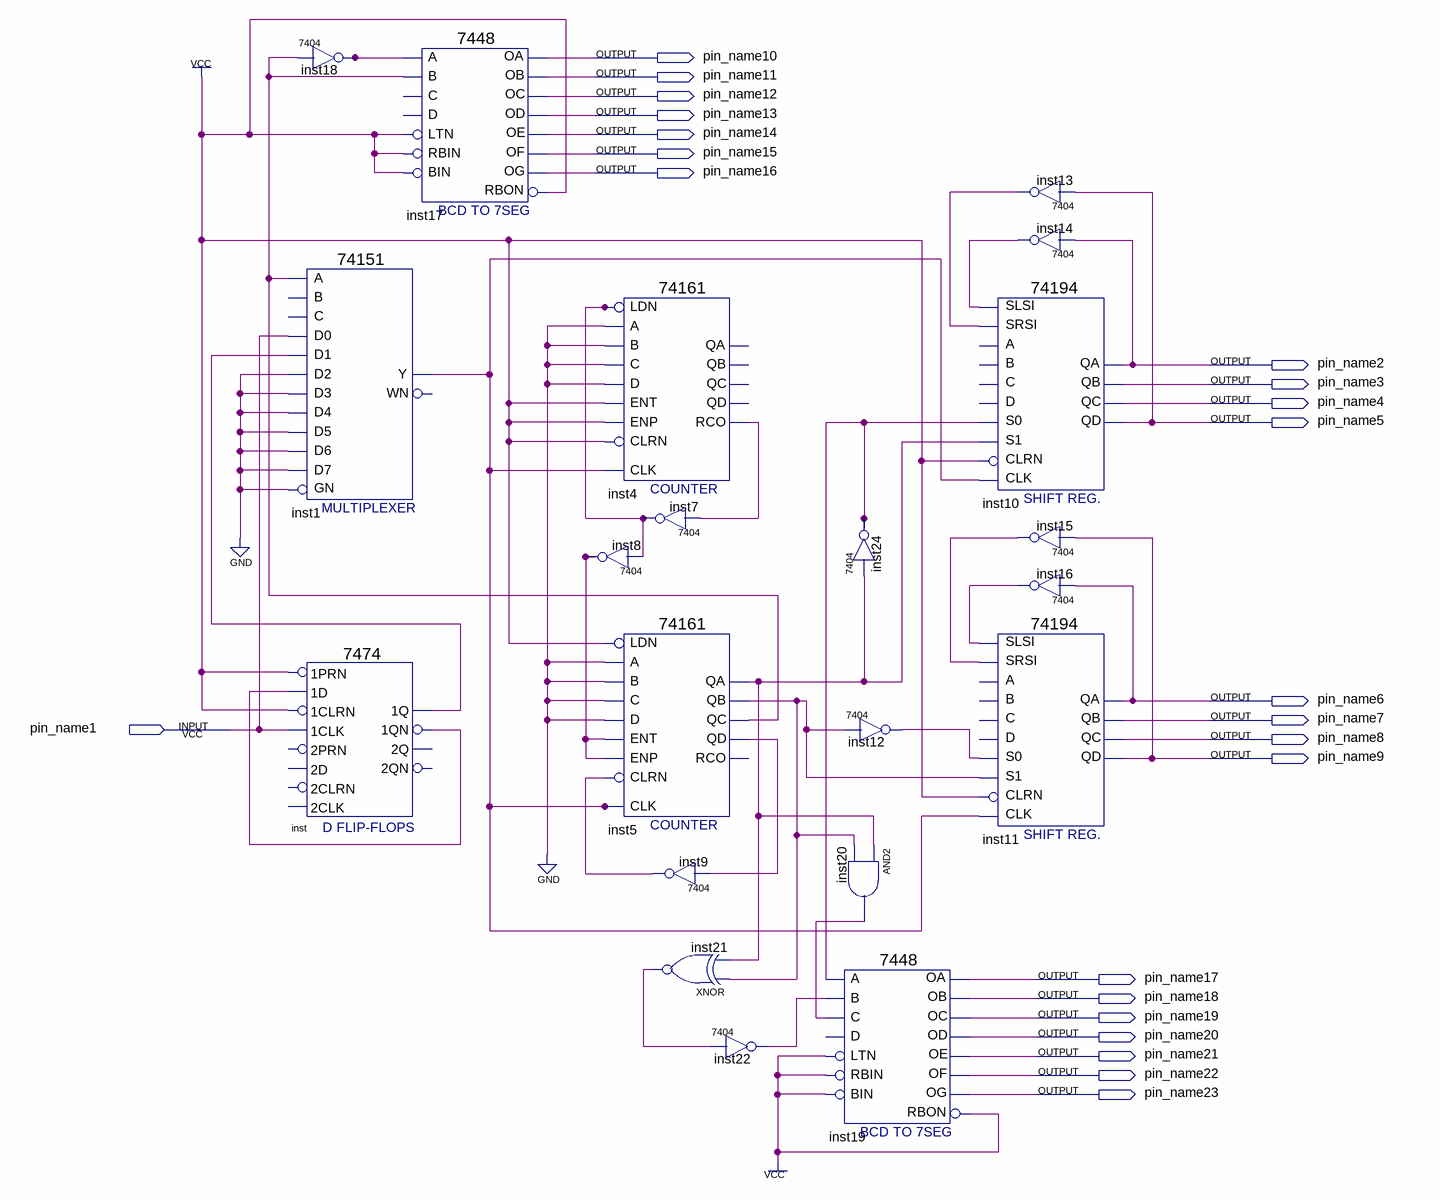
[diagram p0: schematic sheet]
// Quartus schematic first.bdf as structural Verilog: 21 symbols, 23 pins
module first (
  input  pin_name1,
  output pin_name10,
  output pin_name11,
  output pin_name12,
  output pin_name13,
  output pin_name14,
  output pin_name15,
  output pin_name16,
  output pin_name2,
  output pin_name3,
  output pin_name4,
  output pin_name5,
  output pin_name6,
  output pin_name7,
  output pin_name8,
  output pin_name9,
  output pin_name17,
  output pin_name18,
  output pin_name19,
  output pin_name20,
  output pin_name21,
  output pin_name22,
  output pin_name23
);

  wire inst1_y, inst4_rco, inst5_qa, inst5_qb, inst5_qc, inst5_qd, inst7_1, inst8_1, inst9_1, inst12_1,
       inst13_1, inst14_1, inst15_1, inst16_1, inst17_rbon, inst18_1, inst19_rbon, inst20_out, inst21_out,
       inst22_1, inst24_1, inst_1q, inst_1qn;

  \7404  inst18 (.\2 (inst5_qc), .\1 (inst18_1));
  \74151  inst1 (
    .GN(1'b0), .A(inst5_qc), .D5(1'b0), .D0(pin_name1), .D1(inst_1q), .D4(1'b0), .D3(1'b0), .D2(1'b0),
    .D6(1'b0), .D7(1'b0), .Y(inst1_y));  // open: C, B, WN
  \7474  inst (
    .\1CLK (pin_name1), .\1D (inst_1qn), .\1PRN (inst17_rbon), .\1CLRN (inst17_rbon), .\1QN (inst_1qn),
    .\1Q (inst_1q));  // open: 2D, 2PRN, 2CLK, 2CLRN, 2Q, 2QN
  \7448  inst17 (
    .A(inst18_1), .B(inst5_qc), .RBIN(inst17_rbon), .BIN(inst17_rbon), .LTN(inst17_rbon), .OC(pin_name12),
    .OE(pin_name14), .OD(pin_name13), .OF(pin_name15), .OG(pin_name16), .OB(pin_name11), .OA(pin_name10),
    .RBON(inst17_rbon));  // open: C, D
  \74161  inst4 (
    .CLRN(inst17_rbon), .CLK(inst1_y), .ENP(inst17_rbon), .LDN(inst7_1), .A(1'b0), .D(1'b0),
    .ENT(inst17_rbon), .B(1'b0), .C(1'b0), .RCO(inst4_rco));  // open: QD, QC, QB, QA
  \7404  inst8 (.\2 (inst7_1), .\1 (inst8_1));
  \74161  inst5 (
    .CLRN(inst9_1), .CLK(inst1_y), .ENP(inst8_1), .LDN(inst17_rbon), .A(1'b0), .D(1'b0), .ENT(inst8_1),
    .B(1'b0), .C(1'b0), .QD(inst5_qd), .QC(inst5_qc), .QB(inst5_qb), .QA(inst5_qa));  // open: RCO
  \7404  inst7 (.\2 (inst4_rco), .\1 (inst7_1));
  \7404  inst9 (.\2 (inst5_qd), .\1 (inst9_1));
  xnor inst21 (inst21_out, inst5_qb, inst5_qa);
  \7404  inst22 (.\2 (inst21_out), .\1 (inst22_1));
  \7404  inst24 (.\2 (inst5_qa), .\1 (inst24_1));
  \7404  inst12 (.\2 (inst5_qb), .\1 (inst12_1));
  and inst20 (inst20_out, inst5_qa, inst5_qb);
  \7448  inst19 (
    .A(inst24_1), .C(inst20_out), .B(inst22_1), .RBIN(inst19_rbon), .BIN(inst19_rbon), .LTN(inst19_rbon),
    .OC(pin_name19), .OE(pin_name21), .OD(pin_name20), .OF(pin_name22), .OG(pin_name23), .OB(pin_name18),
    .OA(pin_name17), .RBON(inst19_rbon));  // open: D
  \7404  inst13 (.\2 (pin_name5), .\1 (inst13_1));
  \7404  inst14 (.\2 (pin_name2), .\1 (inst14_1));
  \74194  inst10 (
    .SLSI(inst14_1), .SRSI(inst13_1), .CLK(inst1_y), .CLRN(inst17_rbon), .S1(inst5_qa), .S0(inst24_1),
    .QA(pin_name2), .QB(pin_name3), .QC(pin_name4), .QD(pin_name5));  // open: B, C, D, A
  \7404  inst15 (.\2 (pin_name9), .\1 (inst15_1));
  \7404  inst16 (.\2 (pin_name6), .\1 (inst16_1));
  \74194  inst11 (
    .SLSI(inst16_1), .SRSI(inst15_1), .CLK(inst1_y), .CLRN(inst17_rbon), .S1(inst5_qb), .S0(inst12_1),
    .QA(pin_name6), .QB(pin_name7), .QC(pin_name8), .QD(pin_name9));  // open: B, C, D, A
  // also tied to VCC on the sheet: {inst19_rbon, inst17_rbon}
endmodule
